# EAGLE design classic2usb_new (EAGLE 4.16)
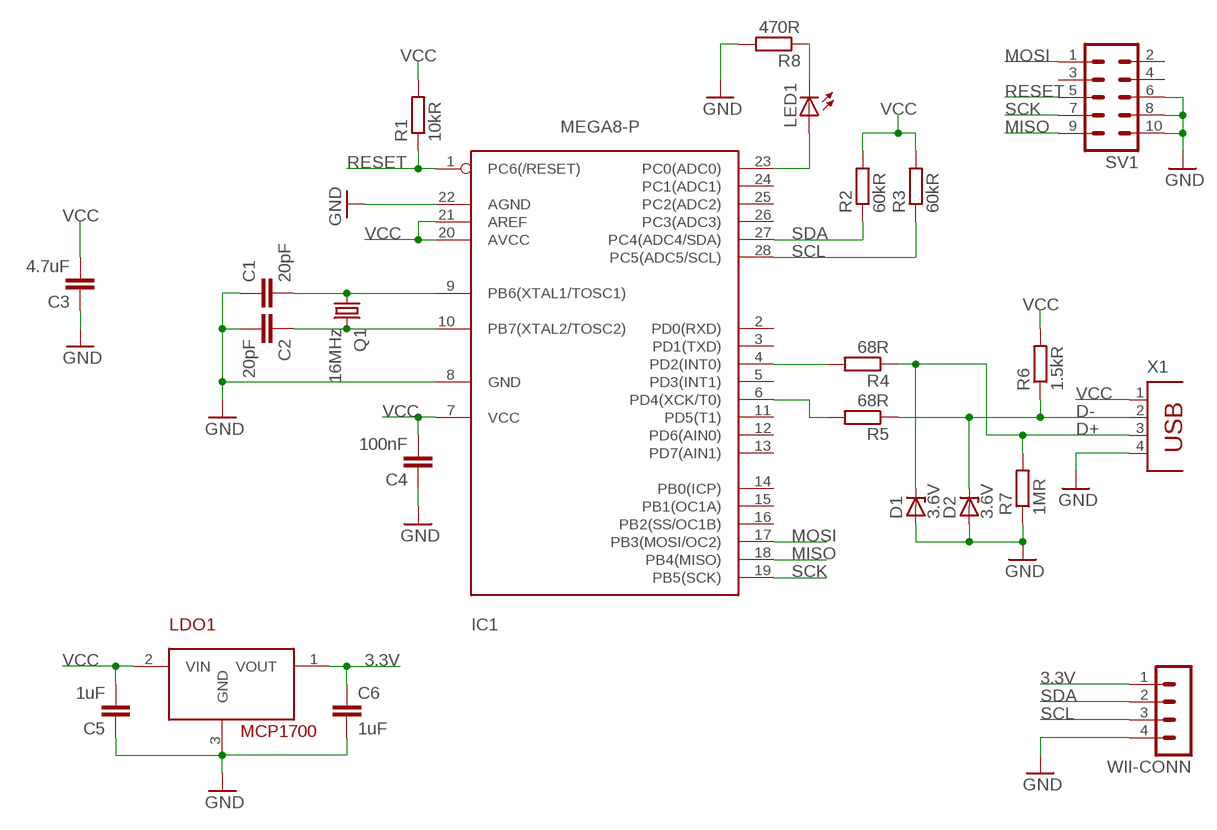
[diagram p0: schematic, sheet 1]

## Parts
C1  20pF  C-EUC1206  [C1206]
C2  20pF  C-EUC1206  [C1206]
C3  4.7uF  C-EUC1206  [C1206]
C4  100nF  C-EUC1206  [C1206]
C5  1uF  C-EUC1206  [C1206]
C6  1uF  C-EUC1206  [C1206]
D1  3.6V  BZV55  [SOD80]
D2  3.6V  BZV55  [SOD80]
IC1  MEGA8-P  [DIL28-3]
LDO1  MCP1700  [TO92-LINE]
LED1  LED3MM  [LED3MM]
Q1  16MHz  CRYSTALHC49S  [HC49/S]
R1  10kR  R-EU_M1206  [M1206]
R2  60kR  R-EU_M1206  [M1206]
R3  60kR  R-EU_M1206  [M1206]
R4  68R  R-EU_M1206  [M1206]
R5  68R  R-EU_M1206  [M1206]
R6  1.5kR  R-EU_M1206  [M1206]
R7  1MR  R-EU_M1206  [M1206]
R8  470R  R-EU_M1206  [M1206]
SV1  MA05-2  [MA05-2]
WII-CONN  MA04-1  [MA04-1]
X1  PN61729  [PN61729]

## Nets
3.3V: C6.1 LDO1.1(VOUT) WII-CONN.1
D+: D1.1(C) R4.1 R7.2 X1.3
D-: D2.1(C) R5.1 R6.1 X1.2
GND: C1.1 C2.2 C3.1 C4.1 C5.1 C6.2 D1.2(A) D2.2(A) IC1.8(GND) IC1.22(AGND) LDO1.3(GND) R7.1 R8.2 SV1.6 SV1.8 SV1.10 WII-CONN.4 X1.4
MISO: IC1.18(PB4(MISO)) SV1.9
MOSI: IC1.17(PB3(MOSI/OC2)) SV1.1
N$1: C1.2 IC1.9(PB6(XTAL1/TOSC1)) Q1.1
N$2: C2.1 IC1.10(PB7(XTAL2/TOSC2)) Q1.2
N$3: IC1.4(PD2(INT0)) R4.2
N$4: IC1.6(PD4(XCK/T0)) R5.2
N$5: LED1.K(C) R8.1
N$6: IC1.23(PC0(ADC0)) LED1.A
RESET: IC1.1(PC6(/RESET)) R1.1 SV1.5
SCK: IC1.19(PB5(SCK)) SV1.7
SCL: IC1.28(PC5(ADC5/SCL)) R3.1 WII-CONN.3
SDA: IC1.27(PC4(ADC4/SDA)) R2.1 WII-CONN.2
VCC: C3.2 C4.2 C5.2 IC1.7(VCC) IC1.20(AVCC) IC1.21(AREF) LDO1.2(VIN) R1.2 R2.2 R3.2 R6.2 X1.1
Unconnected: IC1.2(PD0(RXD)) IC1.3(PD1(TXD)) IC1.5(PD3(INT1)) IC1.11(PD5(T1)) IC1.12(PD6(AIN0)) IC1.13(PD7(AIN1)) IC1.14(PB0(ICP)) IC1.15(PB1(OC1A)) IC1.16(PB2(SS/OC1B)) IC1.24(PC1(ADC1)) IC1.25(PC2(ADC2)) IC1.26(PC3(ADC3)) SV1.2 SV1.3 SV1.4

## Library data of the parts
C1-C6 = rcl:C-EU: CAPACITOR, European symbol
D1 D2 = BZV55:BZV55
IC1 = atmel:MEGA8-P: MICROCONTROLLER 8 Kbytes FLASH 1 kbytes SRAM 512 bytes EEPROM USART 4-channel 10 bit ADC 2-channel 8 bit ADC Source: avr.lbr
LDO1 = MCP1700:MCP1700
LED1 = led:LED: LED OSRAM: - CHIPLED LG R971, LG N971, LY N971, LG Q971, LY Q971, LO R971, LY R971 LH N974, LH R974 LS Q976, LO Q976, LY Q976 LO Q996 - Hyper CHIPLED LW Q18S LB Q993, LB Q99A, LB R99A - SideLED LS A670, LO A670, LY A670, LG A670, LP A670 LB A673, LV A673, LT A673, LW A673 LH A674 LY A675 LS A676, LA A676, LO A676, LY A676, LW A676 LS A679, LY A679, LG A679 - Hyper Micro SIDELED® LS Y876, LA Y876, LO Y876, LY Y876 LT Y87S - SmartLED LW L88C, LW L88S LB L89C, LB L89S, LG L890 LS L89K, LO L89K, LY L89K LS L896, LA L896, LO L896, LY L896 - TOPLED LS T670, LO T670, LY T670, LG T670, LP T670 LSG T670, LSP T670, LSY T670, LOP T670, LYG T670 LG T671, LOG T671, LSG T671 LB T673, LV T673, LT T673, LW T673 LH T674 LS T676, LA T676, LO T676, LY T676, LB T676, LH T676, LSB T676, LW T676 LB T67C, LV T67C, LT T67C, LS T67K, LO T67K, LY T67K, LW E67C LS E67B, LA E67B, LO E67B, LY E67B, LB E67C, LV E67C, LT E67C LW T67C LS T679, LY T679, LG T679 LS T770, LO T770, LY T770, LG T770, LP T770 LB T773, LV T773, LT T773, LW T773 LH T774 LS E675, LA E675, LY E675, LS T675 LS T776, LA T776, LO T776, LY T776, LB T776 LHGB T686 LT T68C, LB T68C - Hyper Mini TOPLED® LB M676 - Mini TOPLED Santana® LG M470 LS M47K, LO M47K, LY M47K Source: http://www.osram.convergy.de - LUMILED® LXK2-PW12-R00, LXK2-PW12-S00, LXK2-PW14-U00, LXK2-PW14-V00 LXK2-PM12-R00, LXK2-PM12-S00, LXK2-PM14-U00 LXK2-PE12-Q00, LXK2-PE12-R00, LXK2-PE12-S00, LXK2-PE14-T00, LXK2-PE14-U00 LXK2-PB12-K00, LXK2-PB12-L00, LXK2-PB12-M00, LXK2-PB14-N00, LXK2-PB14-P00, LXK2-PB14-Q00 LXK2-PR12-L00, LXK2-PR12-M00, LXK2-PR14-Q00, LXK2-PR14-R00 LXK2-PD12-Q00, LXK2-PD12-R00, LXK2-PD12-S00 LXK2-PH12-R00, LXK2-PH12-S00 LXK2-PL12-P00, LXK2-PL12-Q00, LXK2-PL12-R00 Source: www.luxeon.com
Q1 = crystal:CRYSTAL: CRYSTAL
R1-R8 = rcl:R-EU_: RESISTOR, European symbol
SV1 = con-lstb:MA05-2: PIN HEADER
WII-CONN = con-lstb:MA04-1: PIN HEADER
X1 = con-berg:PN61729: BERG USB connector

## Board
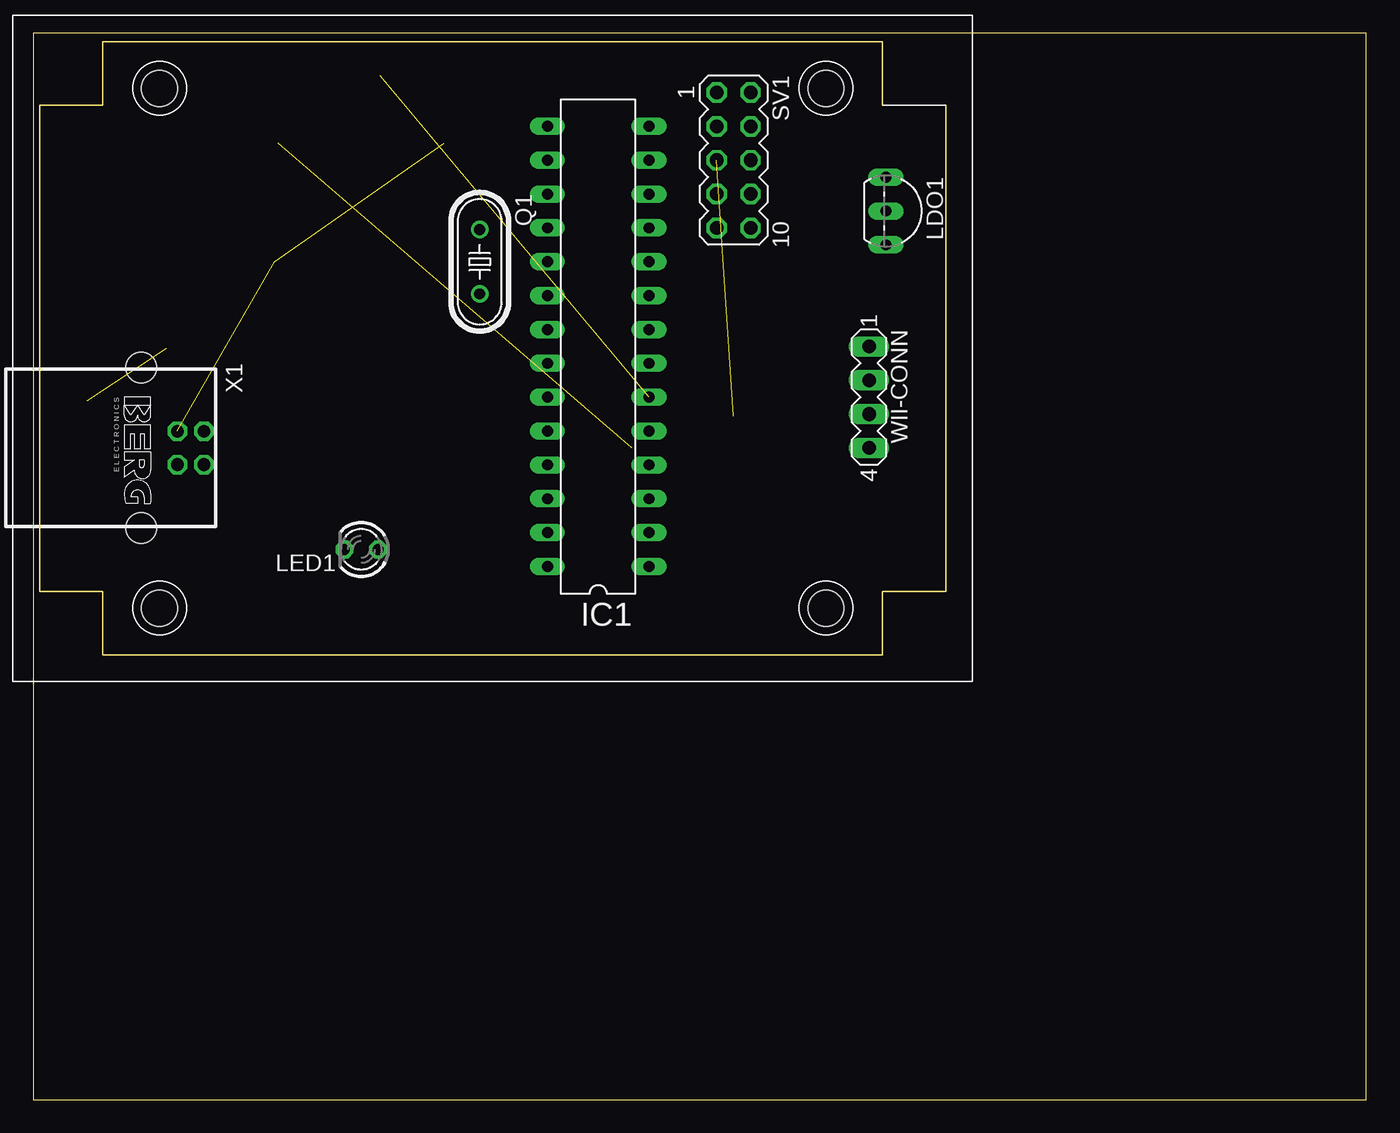
[diagram p1: board, top side]
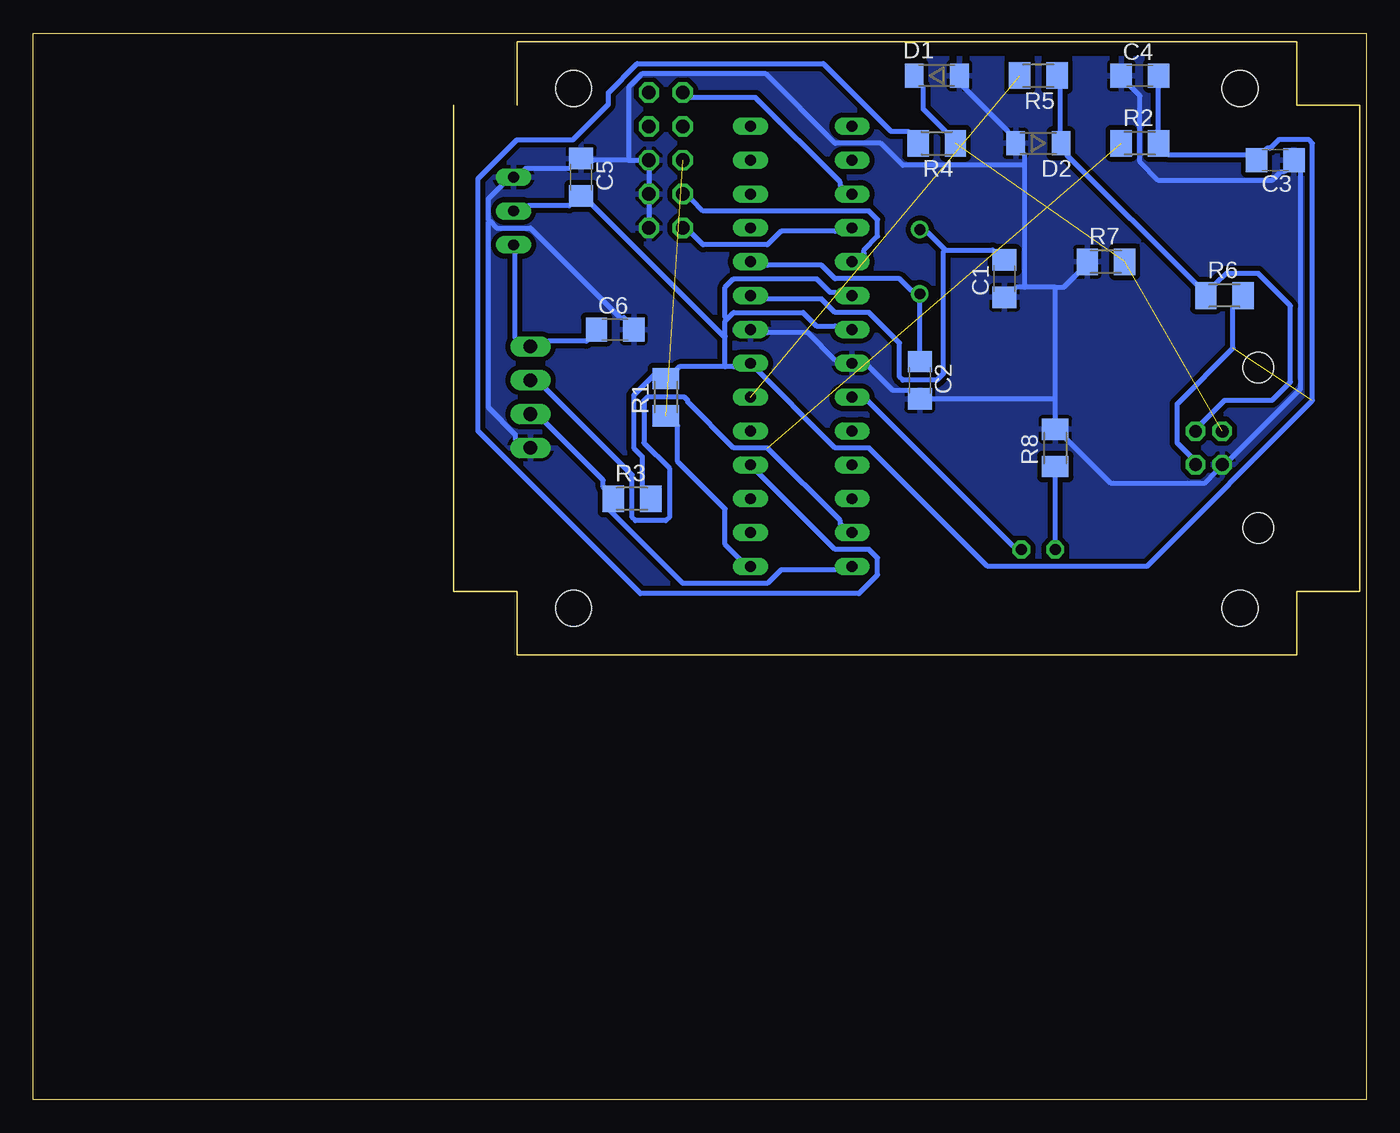
[diagram p2: board, bottom side, seen from below]

Size 100 x 80 mm. Coordinates in mm from the lower left corner, seen from the top.
Outline: 0,0 100,0 100,80 0,80 0,0
Copper layers (1*16): Top 0.035mm / dielectric 1.5mm / Bottom 0.035mm
Design rules "default": minimum track width 15mil, minimum drill 24mil, track to track 15mil, track to pad 15mil, pad to pad 15mil, via to via 8mil, smd to smd 8mil, copper to edge 40mil, drill to drill 8mil, minimum pad ring 10mil, minimum via ring 8mil, stop-mask expansion 4mil, vias tented up to drill 0mil, thermal gap 10mil

### Footprints (pad centres in the part's own frame; a part is rotated, then mirrored left to right if it is on the bottom)
C1206 = smd 1.6 x 1.8: 1 -1.4,0; 2 1.4,0
SOD80 = smd 1.4 x 1.8: 1 -1.7,0; 2 1.7,0
DIL28-3 = drill 0.813 long: 1 -16.51,-3.81; 2 -13.97,-3.81; 3 -11.43,-3.81; 4 -8.89,-3.81; 5 -6.35,-3.81; 6 -3.81,-3.81; 7 -1.27,-3.81; 8 1.27,-3.81; 9 3.81,-3.81; 10 6.35,-3.81; 11 8.89,-3.81; 12 11.43,-3.81; 13 13.97,-3.81; 14 16.51,-3.81; 15 16.51,3.81; 16 13.97,3.81; 17 11.43,3.81; 18 8.89,3.81; 19 6.35,3.81; 20 3.81,3.81; 21 1.27,3.81; 22 -1.27,3.81; 23 -3.81,3.81; 24 -6.35,3.81; 25 -8.89,3.81; 26 -11.43,3.81; 27 -13.97,3.81; 28 -16.51,3.81
TO92-LINE = drill 0.813 long: 1 2.54,0; 2 0,0; 3 -2.54,0
LED3MM = drill 0.813 octagon: A -1.27,0; K 1.27,0
HC49/S = drill 0.813 round: 1 -2.413,0; 2 2.413,0
M1206 = smd 1.6 x 2: 1 -1.4,0; 2 1.4,0
MA05-2 = drill 1.016 octagon: 1 -5.08,-1.27; 2 -5.08,1.27; 3 -2.54,-1.27; 4 -2.54,1.27; 5 0,-1.27; 6 0,1.27; 7 2.54,-1.27; 8 2.54,1.27; 9 5.08,-1.27; 10 5.08,1.27
G028 = hole 2.7: 9,-3.5; 59,-3.5; 9,-42.5; 59,-42.5
MA04-1 = drill 1.016 long: 1 -3.81,0; 2 -1.27,0; 3 1.27,0; 4 3.81,0
PN61729 = drill 0.95 octagon: 1 1.25,4.71; 2 -1.25,4.71; 3 -1.25,2.71; 4 1.25,2.71 | hole 2.3: -6.02,0; 6.02,0

### Placement (x,y rotation side)
C1  27.14,61.59 90 bottom
C2  33.49,53.97 270 bottom
C3  6.82,70.48 180 bottom
C4  16.98,76.83 0 bottom
C5  58.89,69.21 270 bottom
C6  56.35,57.78 0 bottom
D1  32.22,76.83 0 bottom
D2  24.6,71.75 180 bottom
IC1  42.38,56.51 90 top
LDO1  63.97,66.67 270 top
LED1  24.6,41.27 180 top
Q1  33.49,62.86 270 top
R1  52.54,52.7 90 bottom
R2  16.98,71.75 0 bottom
R3  55.08,45.08 0 bottom
R4  32.22,71.75 180 bottom
R5  24.6,76.83 180 bottom
R6  10.63,60.32 0 bottom
R7  19.52,62.86 0 bottom
R8  23.33,48.89 90 bottom
SV1  52.54,70.48 270 top
U$1  [G028]  0.47,79.37 0 top
WII-CONN  62.7,52.7 270 top
X1  8.09,48.89 270 top

### Tracks (layer width: path | path; a pad name or v marks a point on that pad's centre or on a via)
3.3V
  Bottom 0.381: C6.1 58.51,56.89 61.3,56.89 WII-CONN.1 63.84,57.15 63.84,63.5 LDO1.1
D+  (2 unrouted)
  Bottom 0.381: D1.1 33.24,75.94 33.24,74.29 31.58,72.64 R4.1
D-
  Bottom 0.381: R5.1 22.95,75.94 22.95,72.64 D2.1 22.44,70.86 12.79,61.21 R6.1 11.27,61.21 10.5,61.97 8.09,61.97 5.68,59.56 5.68,53.84 7.07,52.45 10.63,52.45 12.41,50.67 X1.2
GND
  Bottom 0.381: SV1.10 SV1.8 SV1.6 55.33,70.48 | 65.75,65.91 65.88,66.03 65.88,67.56 64.86,68.57 LDO1.3 63.08,69.84 59.78,69.84 C5.1 58,70.48 55.33,70.48 | 65.75,65.91 65.24,65.4 62.7,65.4 55.97,58.67 55.71,58.67 C6.2 | WII-CONN.4 63.84,49.53 63.84,49.91 65.88,51.94 65.88,65.78 65.75,65.91 | C4.1 17.61,75.94 16.98,75.31 16.98,70.35 15.58,68.96 7.07,68.96 6.44,69.59 6.18,69.59 C3.1 4.92,69.59 4.92,53.34 10.25,48 X1.4 11.27,47.11 12.15,46.22 19.14,46.22 22.44,49.53 R8.2 23.33,52.57 | IC1.8 44.92,57.53 41.87,57.53 39.84,55.49 IC1.22 37.3,54.99 35.52,53.21 34.38,53.21 C2.2 32.6,52.57 23.33,52.57 | D1.2 30.19,75.94 26.89,72.64 D2.2 25.62,70.86 25.62,70.1 | 23.33,60.96 22.7,60.96 21.68,61.97 R7.1 | 23.33,60.96 25.62,60.96 | 25.62,60.96 26.25,60.96 C1.1 | 23.33,52.57 23.33,60.96 | 25.62,60.96 25.62,70.1 | 55.33,70.48 55.33,75.94 54.32,76.96 45.05,76.96 39.84,71.75 36.41,71.75 34.76,70.1 25.62,70.1
  pour Bottom: 1.74,79.37 67.78,79.37 67.78,33.65 0.47,33.65 0.47,79.37
MISO
  Bottom 0.381: IC1.18 39.84,65.15 43.9,65.15 44.92,64.13 49.75,64.13 50.63,65.02 SV1.9
MOSI
  Bottom 0.381: IC1.17 39.46,68.57 39.46,68.83 45.81,75.18 50.63,75.18 SV1.1
N$1
  Bottom 0.381: 31.58,63.75 28.03,63.75 C1.2 | 31.58,63.75 32.85,65.02 Q1.1 | IC1.9 44.92,60.07 40.86,60.07 39.84,59.05 37.3,59.05 35.01,56.76 35.01,54.22 34.76,53.97 32.22,53.97 31.71,54.48 31.71,63.62 31.58,63.75
N$2
  Bottom 0.381: C2.1 Q1.2 34.12,60.7 35.01,61.59 39.84,61.59 40.86,62.61 44.92,62.61 IC1.10
N$3
  Bottom 0.381: R4.2 34.38,72.64 35.65,72.64 40.73,77.72 54.7,77.72 56.86,75.56 56.86,74.67 59.52,72 63.72,72 66.64,69.08 66.64,50.16 54.45,37.97 38.06,37.97 36.66,39.37 36.66,40.64 37.3,41.27 39.84,41.27 IC1.4
N$4  (1 unrouted)
N$5
  Bottom 0.381: LED1.K R8.1
N$6
  Bottom 0.381: LED1.A 26.5,41.52 37.43,52.45 IC1.23
RESET  (1 unrouted)
  Bottom 0.381: R1.1 51.65,50.54 51.65,47.87 48.09,44.32 48.09,41.65 47.08,40.64 IC1.1
SCK
  Bottom 0.381: IC1.19 37.68,63.5 37.68,63.75 36.66,64.77 36.66,66.03 37.3,66.67 49.75,66.67 50.63,67.56 SV1.7
SCL
  Bottom 0.381: WII-CONN.3 61.56,50.8 57.24,46.48 57.24,45.97 R3.1 56.73,44.19 51.27,38.73 44.92,38.73 43.9,39.75 39.84,39.75 IC1.28
SDA  (1 unrouted)
  Bottom 0.381: IC1.27 39.46,43.18 39.46,43.43 44.92,48.89 47.46,48.89 50.89,52.32 50.89,52.45 51.14,52.7 53.94,52.7 54.19,52.45 54.19,49.27 52.29,47.37 52.29,43.68 52.54,43.43 54.83,43.43 55.08,43.68 55.08,46.86 61.56,53.34 WII-CONN.2
VCC  (1 unrouted)
  Bottom 0.381: C4.2 15.58,75.94 15.58,72.64 R2.2 14.82,70.86 8.98,70.86 C3.2 7.46,71.37 7.2,71.37 6.57,72 4.28,72 4.03,71.75 4.03,52.45 16.47,40 28.41,40 37.3,48.89 39.84,48.89 IC1.7 47.46,54.99 48.09,54.99 | LDO1.2 62.83,67.05 59.78,67.05 C5.2 58,67.05 48.22,57.27 48.09,57.27 | R3.2 54.32,45.97 54.32,48.26 54.95,48.89 54.95,52.83 53.43,54.35 R1.2 51.65,54.86 51.52,54.99 48.09,54.99 | 47.97,58.54 48.09,58.41 48.09,57.27 | 47.97,58.54 47.46,59.05 42.25,59.05 41.24,58.03 39.84,58.03 IC1.21 | 48.09,54.99 48.09,57.27 | IC1.20 39.84,60.57 40.22,60.57 41.24,61.59 47.46,61.59 48.09,60.96 48.09,58.67 47.97,58.54 | R6.2 10,59.43 10,56.38 14.19,52.19 14.19,49.27 13.17,48.26 X1.1